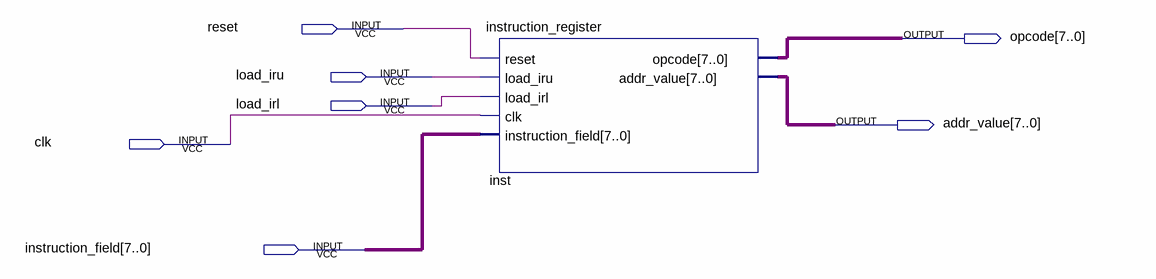
[diagram p0: schematic sheet]
// Quartus schematic ir_sim_tb.bdf as structural Verilog: 1 symbols, 7 pins
module ir_sim_tb (
  input  reset,
  input  load_iru,
  input  load_irl,
  input  clk,
  input  [7:0] instruction_field,
  output [7:0] opcode,
  output [7:0] addr_value
);

  instruction_register inst (
    .reset(reset), .load_iru(load_iru), .load_irl(load_irl), .clk(clk),
    .instruction_field(instruction_field), .opcode(opcode), .addr_value(addr_value));
endmodule
